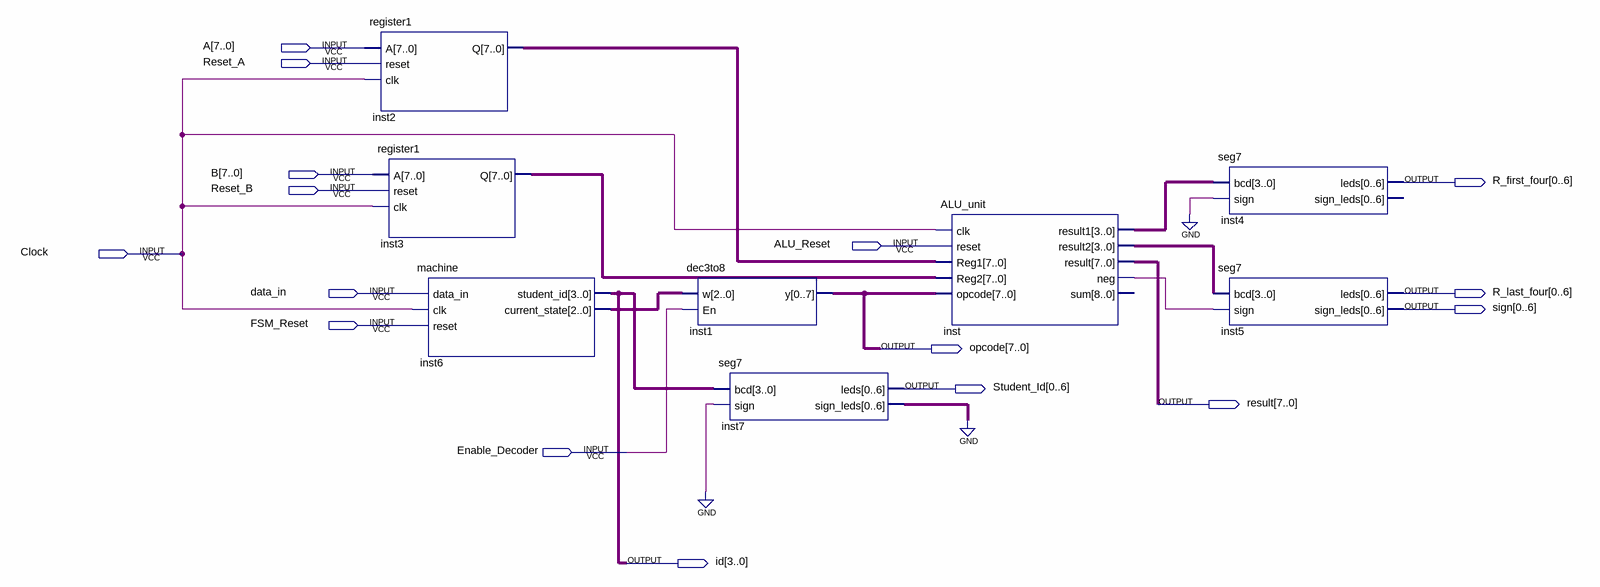
[diagram p0: schematic sheet]
// Quartus schematic Question1.bdf as structural Verilog: 8 symbols, 16 pins
module Question1 (
  input  [7:0] A,
  input  Reset_A,
  input  [7:0] B,
  input  Reset_B,
  input  ALU_Reset,
  input  Clock,
  input  data_in,
  input  FSM_Reset,
  input  Enable_Decoder,
  output [0:6] R_first_four,
  output [0:6] R_last_four,
  output [0:6] sign,
  output [7:0] opcode,
  output [0:6] Student_Id,
  output [7:0] result,
  output [3:0] id
);

  wire inst_neg;
  wire [2:0] inst6_current_state;
  wire [3:0] inst_result1, inst_result2;
  wire [6:0] inst7_sign_leds;
  wire [7:0] inst2_q, inst3_q;

  register1 inst2 (.A(A), .reset(Reset_A), .clk(Clock), .Q(inst2_q));
  register1 inst3 (.A(B), .reset(Reset_B), .clk(Clock), .Q(inst3_q));
  machine inst6 (
    .data_in(data_in), .clk(Clock), .reset(FSM_Reset), .student_id(id), .current_state(inst6_current_state));
  dec3to8 inst1 (.w(inst6_current_state), .En(Enable_Decoder), .y(opcode));
  seg7 inst7 (.bcd(id), .sign(1'b0), .leds(Student_Id), .sign_leds(inst7_sign_leds));
  ALU_unit inst (
    .clk(Clock), .reset(ALU_Reset), .Reg1(inst2_q), .Reg2(inst3_q), .opcode(opcode), .result1(inst_result1),
    .result2(inst_result2), .result(result), .neg(inst_neg));  // open: sum
  seg7 inst4 (.bcd(inst_result1), .sign(1'b0), .leds(R_first_four));  // open: sign_leds
  seg7 inst5 (.bcd(inst_result2), .sign(inst_neg), .leds(R_last_four), .sign_leds(sign));
  // also tied to GND on the sheet: {inst7_sign_leds[0], inst7_sign_leds[1], inst7_sign_leds[2], inst7_sign_leds[3], inst7_sign_leds[4], inst7_sign_leds[5], inst7_sign_leds[6]}
endmodule
